# EasyEDA Pro project HT42B564-breakout.epro

# Schematic Schematic2
Board Name: CH37B Test Breakout; Create Date: 2025-04-11; Page Name: P1; Project Name: KeyStick; Schematic Name: Schematic2; Update Date: 2025-04-11; Company: EasyEDA.com; Page Size: A4; Version: V1.0
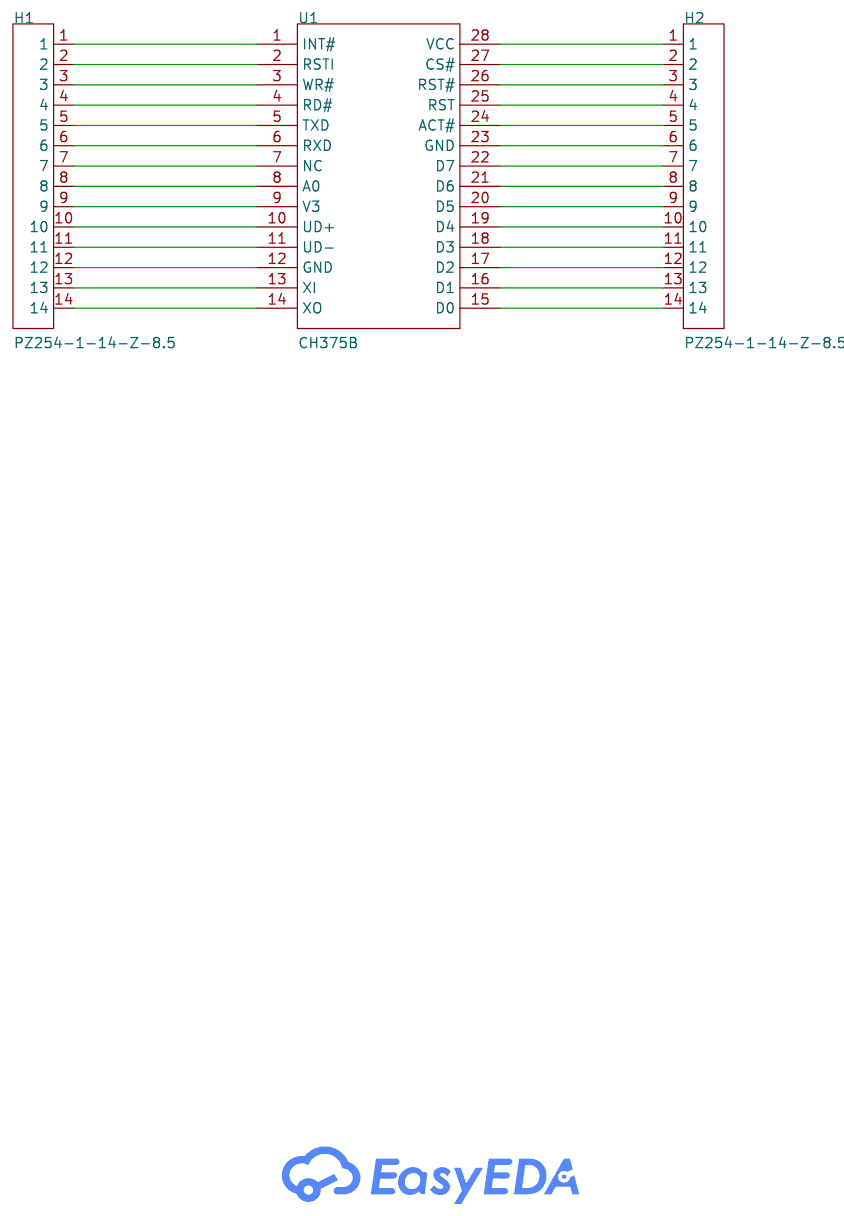
[diagram p0: schematic sheet]

## Parts
H1  PZ254-1-14-Z-8.5  [HDR-TH_14P-P2.54-V-M]
H2  PZ254-1-14-Z-8.5  [HDR-TH_14P-P2.54-V-M]
U1  CH375B  [SOIC-28_L17.9-W7.5-P1.27-LS10.3-BL]

## Library data of the parts
H1 H2 = PZ254-1-14-Z-8.5: Pin Structure:1x14P Pitch:2.54mm Row Spacing:- Circluar Pins/Square Pins:Policy Mounting Type:Straight Number of Rows:Single Row Number of Pins:14P Current Rating:3A Voltage Rating (Max):- Length of Mating Pin:6mm Insulation Height:2.5mm Length of End Con; LCSC Part Name: 1x14P 间距:2.54mm 方针 直插; Supplier Part: C2894937; Manufacturer: HCTL(华灿天禄); Supplier Footprint: 插件,P=2.54mm; JLCPCB Part Class: Extended Part; Datasheet: https://atta.szlcsc.com/upload/public/pdf/source/20240305/0F0A2A5C422E5D195558C9C26715A031.pdf; Supplier: LCSC; Pin Structure: 1x14P; Pitch: 2.54mm; Circluar Pins/Square Pins: Policy; Mounting Type: Straight; Number of Rows: Single Row; Number of Pins: 14P; Current Rating: 3A; Length of Mating Pin: 6mm; Insulation Height: 2.5mm; Length of End Connection Pin: 3mm; Contact Material: Brass; Operating Temperature: -40℃~+105℃; Color: Black
U1 = CH375B: Applications Function:Transceiver Protocol: Supply Voltage:3.3V；5V Supply Voltage:3.3V；5V Data Rate:12Mbps; LCSC Part Name: USB总线接口芯片CH375; Supplier Part: C8962; Manufacturer: WCH(南京沁恒); Supplier Footprint: SOP-28-300mil; JLCPCB Part Class: Extended Part; Datasheet: https://atta.szlcsc.com/upload/public/pdf/source/20240313/E60A362E05AFE3BBC545118421D5F1A4.pdf; Supplier: LCSC; Applications Function: Transceiver; Supply Voltage: 3.3V；5V; Data Rate: 12Mbps

## Nets
$1N662: H1.1 U1.1(INT#)
$1N666: H1.2 U1.2(RSTI)
$1N671: H1.3 U1.3(WR#)
$1N676: H1.4 U1.4(RD#)
$1N681: H1.5 U1.5(TXD)
$1N686: H1.6 U1.6(RXD)
$1N694: H1.7 U1.7(NC)
$1N698: H1.8 U1.8(A0)
$1N703: H1.9 U1.9(V3)
$1N711: H1.10 U1.10(UD+)
$1N715: H1.11 U1.11(UD-)
$1N720: H1.12 U1.12(GND)
$1N725: H1.13 U1.13(XI)
$1N730: H1.14 U1.14(XO)
$1N735: H2.1 U1.28(VCC)
$1N740: H2.2 U1.27(CS#)
$1N745: H2.3 U1.26(RST#)
$1N750: H2.4 U1.25(RST)
$1N755: H2.5 U1.24(ACT#)
$1N760: H2.6 U1.23(GND)
$1N765: H2.7 U1.22(D7)
$1N770: H2.8 U1.21(D6)
$1N775: H2.9 U1.20(D5)
$1N780: H2.10 U1.19(D4)
$1N785: H2.11 U1.18(D3)
$1N790: H2.12 U1.17(D2)
$1N795: H2.13 U1.16(D1)
$1N800: H2.14 U1.15(D0)

# Schematic Schematic1
Board Name: V1; Create Date: 2025-04-10; Page Name: P1; Project Name: KeyStick; Schematic Name: Schematic1; Update Date: 2025-04-10; Company: EasyEDA.com; Page Size: A4; Version: V1.0
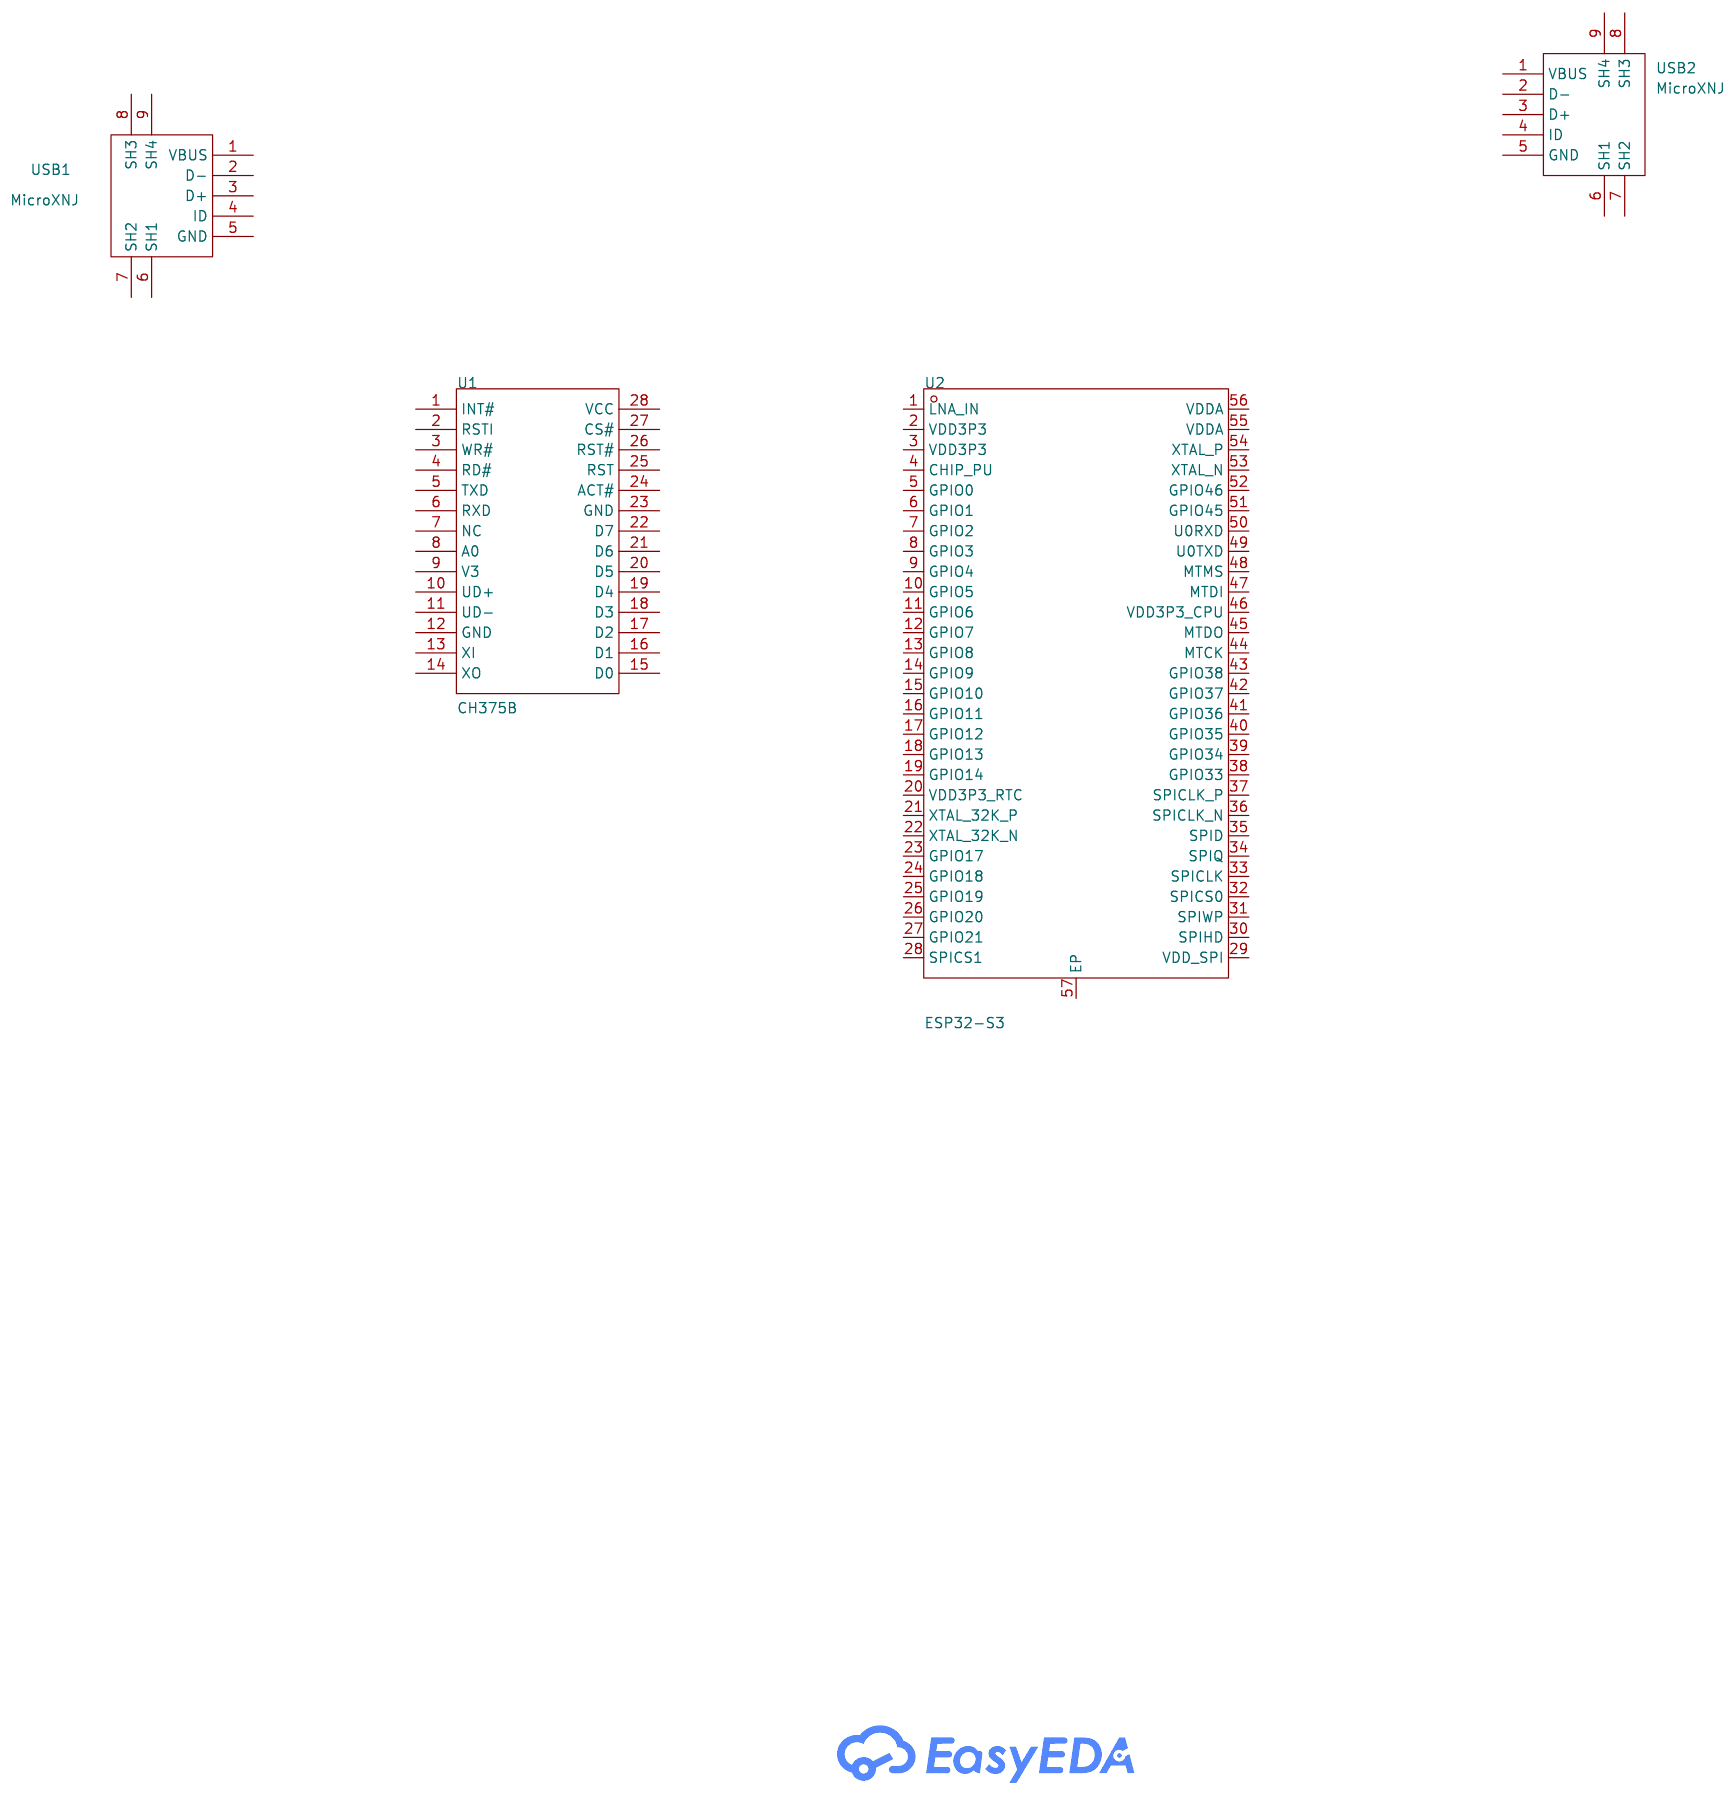
[diagram p1: schematic sheet]

## Parts
U1  CH375B  [SOIC-28_L17.9-W7.5-P1.27-LS10.3-BL]
U2  ESP32-S3  [QFN-56_L7.0-W7.0-P0.40-TL-EP4.0]
USB1  MicroXNJ  [MICRO-USB-SMD_MICROXNJ]
USB2  MicroXNJ  [MICRO-USB-SMD_MICROXNJ]

## Library data of the parts
U1 = CH375B: Applications Function:Transceiver Protocol: Supply Voltage:3.3V；5V Supply Voltage:3.3V；5V Data Rate:12Mbps; LCSC Part Name: USB总线接口芯片CH375; Supplier Part: C8962; Manufacturer: WCH(南京沁恒); Supplier Footprint: SOP-28-300mil; JLCPCB Part Class: Extended Part; Datasheet: https://atta.szlcsc.com/upload/public/pdf/source/20240313/E60A362E05AFE3BBC545118421D5F1A4.pdf; Supplier: LCSC; Applications Function: Transceiver; Supply Voltage: 3.3V；5V; Data Rate: 12Mbps
U2 = ESP32-S3: Frequency Range:2412MHz~2484MHz Frequency Range:2412MHz~2484MHz Interface:ADC,GPIO,I2C,I2S,PWM,SPI,UART,USB Operating Voltage:3V~3.6V Operating Voltage:3V~3.6V Applications:WiFi；IoT Output Power:21dBm Data Rate:150Mbps Current Of Transmitting:340mA Sensit; LCSC Part Name: 支持2.4GHz WIFI和低功耗蓝牙的MCU SoC; Supplier Part: C2913192; Manufacturer: ESPRESSIF(乐鑫); Supplier Footprint: QFN-56-EP(7x7); JLCPCB Part Class: Extended Part; Datasheet: https://atta.szlcsc.com/upload/public/pdf/source/20241030/3428D9BCA56E860957850BFAF37EAC62.pdf; Supplier: LCSC; Frequency Range: 2412MHz~2484MHz; Interface: ADC,GPIO,I2C,I2S,PWM,SPI,UART,USB; Operating Voltage: 3V~3.6V; Applications: WiFi；IoT; Output Power: 21dBm; Data Rate: 150Mbps; Current Of Transmitting: 340mA; Sensitivity: -98.4dBm; Receive Current: 88mA; Typical Application Frequency: 2.4GHz; Operating Temperature: -40℃~+105℃
USB1 USB2 = MicroXNJ: Connector Type:Micro-B Standard:USB 2.0 Gender:Female Mounting Style:Horizontal attachment Number of Contacts:5P Number of Ports:1 Current Rating - Power (Max):1.8A Operating Temperature Range:-20℃~+85℃ Operating Temperature Range:-20℃~+85℃ Rated Voltage; LCSC Part Name: Micro-B 母 卧贴; Supplier Part: C404969; Manufacturer: SHOU HAN(首韩); Supplier Footprint: SMD; JLCPCB Part Class: Extended Part; Datasheet: https://atta.szlcsc.com/upload/public/pdf/source/20220415/2494EDFF499AF6F852F7C820374B6AF3.pdf; Supplier: LCSC; Connector Type: Micro-B; Standard: USB 2.0; Gender: Female; Mounting Style: Horizontal attachment; Number of Contacts: 5P; Number of Ports: 1; Current Rating - Power (Max): 1.8A; Operating Temperature Range: -20℃~+85℃; Rated Voltage (Max): 30V; Connect-Disconnect Life: 5000 Cuts; Core Colour: Black

## Nets

Not connected (* = marked no-connect by the designer): U1 1(INT#) 2(RSTI) 3(WR#) 4(RD#) 5(TXD) 6(RXD) 7(NC) 8(A0) 9(V3) 10(UD+) 11(UD-) 12(GND) 13(XI) 14(XO) 15(D0) 16(D1) 17(D2) 18(D3) 19(D4) 20(D5) 21(D6) 22(D7) 23(GND) 24(ACT#) 25(RST) 26(RST#) 27(CS#) 28(VCC); U2 1(LNA_IN) 2(VDD3P3) 3(VDD3P3) 4(CHIP_PU) 5(GPIO0) 6(GPIO1) 7(GPIO2) 8(GPIO3) 9(GPIO4) 10(GPIO5) 11(GPIO6) 12(GPIO7) 13(GPIO8) 14(GPIO9) 15(GPIO10) 16(GPIO11) 17(GPIO12) 18(GPIO13) 19(GPIO14) 20(VDD3P3_RTC) 21(XTAL_32K_P) 22(XTAL_32K_N) 23(GPIO17) 24(GPIO18) 25(GPIO19) 26(GPIO20) 27(GPIO21) 28(SPICS1) 29(VDD_SPI) 30(SPIHD) 31(SPIWP) 32(SPICS0) 33(SPICLK) 34(SPIQ) 35(SPID) 36(SPICLK_N) 37(SPICLK_P) 38(GPIO33) 39(GPIO34) 40(GPIO35) 41(GPIO36) 42(GPIO37) 43(GPIO38) 44(MTCK) 45(MTDO) 46(VDD3P3_CPU) 47(MTDI) 48(MTMS) 49(U0TXD) 50(U0RXD) 51(GPIO45) 52(GPIO46) 53(XTAL_N) 54(XTAL_P) 55(VDDA) 56(VDDA) 57(EP); USB1 1(VBUS) 2(D-) 3(D+) 4(ID) 5(GND) 6(SH1) 7(SH2) 8(SH3) 9(SH4); USB2 1(VBUS) 2(D-) 3(D+) 4(ID) 5(GND) 6(SH1) 7(SH2) 8(SH3) 9(SH4)

# Schematic Schematic3
Board Name: HT42B564 Test Breakout; Create Date: 2025-04-17; Page Name: P1; Project Name: KeyStick; Schematic Name: Schematic3; Update Date: 2025-04-17; Company: EasyEDA.com; Page Size: A4; Version: V1.0
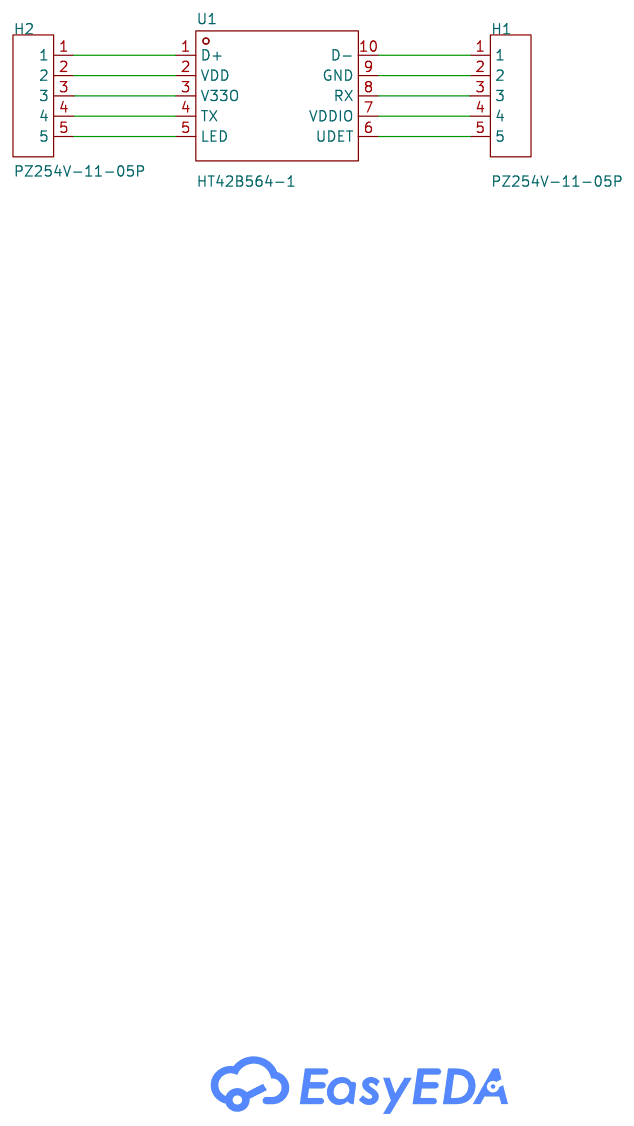
[diagram p2: schematic sheet]

## Parts
H1  PZ254V-11-05P  [HDR-TH_5P-P2.54-V-M]
H2  PZ254V-11-05P  [HDR-TH_5P-P2.54-V-M]
U1  HT42B564-1  [SSOP-10_L4.9-W3.9-P1.00-LS6.0-BL]

## Library data of the parts
H1 H2 = PZ254V-11-05P: Pin Structure:1x5P Pitch:2.54mm Row Spacing:- Circluar Pins/Square Pins:Policy Mounting Type:Straight Number of Rows:Single Row Number of Pins:5P Current Rating:- Voltage Rating (Max):- Length of Mating Pin:6mm Insulation Height:2.5mm Length of End Connec; LCSC Part Name: 1x5P 间距:2.54mm 方针 直插; Supplier Part: C492404; Manufacturer: XFCN(兴飞); Supplier Footprint: 插件,P=2.54mm; JLCPCB Part Class: Extended Part; Datasheet: https://atta.szlcsc.com/upload/public/pdf/source/20200309/C492404_E51533260F8710EFF5D4617281164C1D.pdf; Supplier: LCSC; Pin Structure: 1x5P; Pitch: 2.54mm; Circluar Pins/Square Pins: Policy; Mounting Type: Straight; Number of Rows: Single Row; Number of Pins: 5P; Length of Mating Pin: 6mm; Insulation Height: 2.5mm; Length of End Connection Pin: 3mm; Contact Material: Brass; Operating Temperature: -40℃~+105℃; Color: Black
U1 = HT42B564-1: Applications Function:USB转UART Protocol:UART Number of Channels:- Supply Voltage:3.3V~5.5V Supply Voltage:3.3V~5.5V Data Rate:- Operating Temperature:- Operating Temperature:-; Supplier Part: C109026; Manufacturer: HOLTEK(合泰/盛群); Supplier Footprint: SOP-10; JLCPCB Part Class: Extended Part; Datasheet: https://atta.szlcsc.com/upload/public/pdf/source/20240403/82092C50D54317D0FB1B4FEE6092E3E6.pdf; Supplier: LCSC; Applications Function: USB转UART; Protocol: UART; Supply Voltage: 3.3V~5.5V

## Nets
$1N293: H2.1 U1.1(D+)
$1N297: H2.2 U1.2(VDD)
$1N302: H2.3 U1.3(V33O)
$1N307: H2.4 U1.4(TX)
$1N312: H2.5 U1.5(LED)
$1N317: H1.1 U1.10(D-)
$1N322: H1.2 U1.9(GND)
$1N327: H1.3 U1.8(RX)
$1N332: H1.4 U1.7(VDDIO)
$1N337: H1.5 U1.6(UDET)

# Board PCB2
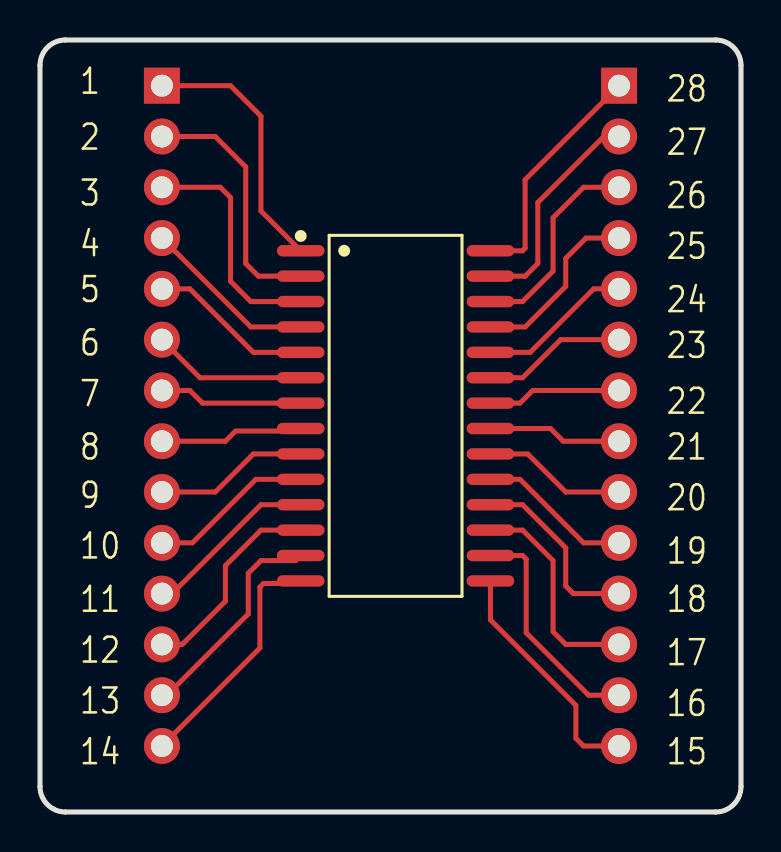
[diagram p3: board, top side]
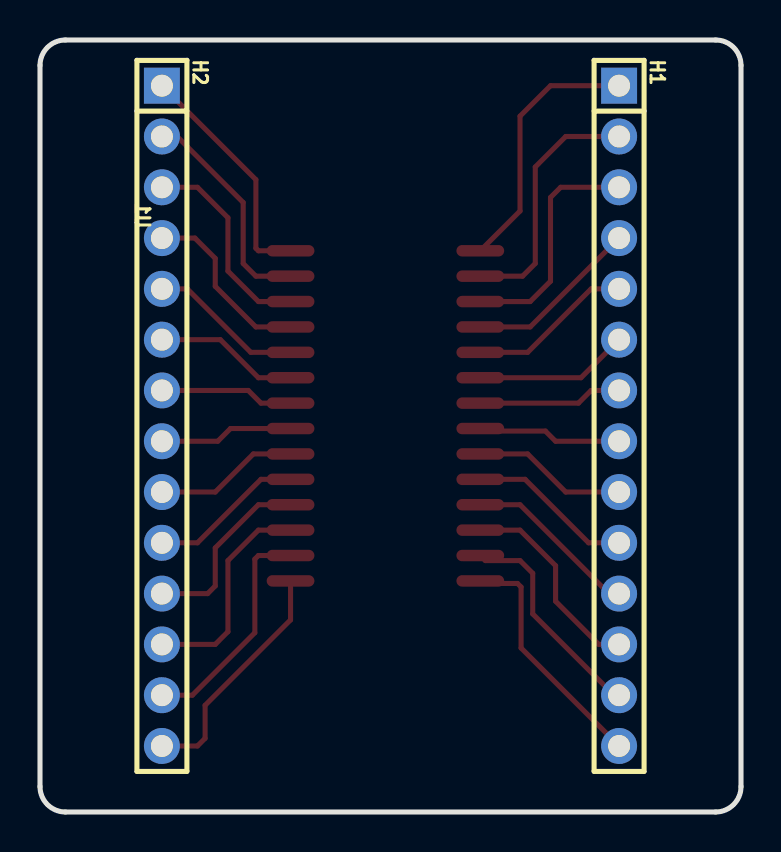
[diagram p4: board, bottom side, seen from below]

Outline 35.05 x 38.61 mm; copper layers: Top Layer, Bottom Layer. Coordinates in mm from the lower left corner of the outline.
Outline path: 0,37.34 0,1.27 arc(0.37,0.37) 1.27,0 33.78,0 arc(34.68,0.37) 35.05,1.27 35.05,37.34 arc(34.68,38.24) 33.78,38.61 1.27,38.61 arc(0.37,38.24) 0,37.34
Stack: Top Layer 0.035mm / Dielectric1 1.51mm FR4 er 4.5 / Bottom Layer 0.035mm

## Design rules (mm)
template: JLCPCB Capability(Two Layers Board)
spacing copperThickness1oz (default): track to track 0.102, other pairs 0.152 to 0.3
spacing copperThickness2oz: track to track 0.203, other pairs 0.152 to 0.3
track width copperThickness1oz (default): min 0.127, default 0.254, max 2.54
track width copperThickness2oz: min 0.203, default 0.254, max 2.54
differential pair differentialPair (default): width min 0.127, default 0.254, max 2.54; gap min 0.152, default 0.152
via viaSize (default): diameter min 0.5, default 0.61, max 10; hole min 0.3, default 0.305, max 6.3

## Placement (name value [footprint] x y rotation side)
H1  PZ254-1-14-Z-8.5  [HDR-TH_14P-P2.54-V-M]  6.1 19.81 270 bottom
H2  PZ254-1-14-Z-8.5  [HDR-TH_14P-P2.54-V-M]  28.96 19.81 270 bottom
U1  CH375B  [SOIC-28_L17.9-W7.5-P1.27-LS10.3-BL]  17.78 19.81 270 top

## Footprints (pads in the part's own frame, mm; a bottom-side part is the same pattern mirrored in y, then rotated)
HDR-TH_14P-P2.54-V-M
  rect 1.8x1.8 hole 1.1: 1(-16.51,0)
  round 1.8 hole 1.1: 2(-13.97,0) 3(-11.43,0) 4(-8.89,0) 5(-6.35,0) 6(-3.81,0) 7(-1.27,0) 8(1.27,0) 9(3.81,0) 10(6.35,0) 11(8.89,0) 12(11.43,0) 13(13.97,0) 14(16.51,0)
SOIC-28_L17.9-W7.5-P1.27-LS10.3-BL
  oval 0.574x2.388 smd: 1(-8.255,-4.744) 2(-6.985,-4.744) 3(-5.715,-4.744) 4(-4.445,-4.744) 5(-3.175,-4.744) 6(-1.905,-4.744) 7(-0.635,-4.744) 8(0.635,-4.744) 9(1.905,-4.744) 10(3.175,-4.744) 11(4.445,-4.744) 12(5.715,-4.744) 13(6.985,-4.744) 14(8.255,-4.744) 15(8.255,4.744) 16(6.985,4.744) 17(5.715,4.744) 18(4.445,4.744) 19(3.175,4.744) 20(1.905,4.744) 21(0.635,4.744) 22(-0.635,4.744) 23(-1.905,4.744) 24(-3.175,4.744) 25(-4.445,4.744) 26(-5.715,4.744) 27(-6.985,4.744) 28(-8.255,4.744)

## Nets
As in the schematic.

## Routing (per net, layer and track width the routed paths; a pad name or vN(x,y) marks a point on that pad's centre or on a via; arc(x,y) is an arc through that point)
$1N662: length 13.1
  Top Layer w0.254: U1.1 11.05,30.05 11.05,34.8 9.53,36.32 H1.1
$1N666: length 12.7
  Top Layer w0.254: H1.2 8.76,33.78 10.29,32.26 10.29,27.43 10.92,26.8 U1.2
$1N671: length 11.8
  Top Layer w0.254: U1.3 10.54,25.53 9.53,26.54 9.53,30.73 9.02,31.24 H1.3
$1N676: length 8.8
  Top Layer w0.254: H1.4 10.54,24.26 U1.4
$1N681: length 8.3
  Top Layer w0.254: H1.5 7.49,26.16 10.67,22.99 U1.5
$1N686: length 7.7
  Top Layer w0.254: U1.6 8,21.72 H1.6
$1N694: length 7.2
  Top Layer w0.254: U1.7 8.13,20.45 7.49,21.08 H1.7
$1N698: length 7.2
  Top Layer w0.254: H1.8 9.27,18.54 9.78,19.05 12.91,19.05 U1.8
$1N703: length 7.7
  Top Layer w0.254: U1.9 10.67,17.91 8.76,16 H1.9
$1N711: length 8.3
  Top Layer w0.254: H1.10 7.62,13.46 10.8,16.64 U1.10
$1N715: length 8.8
  Top Layer w0.254: H1.11 6.6,10.92 11.05,15.37 U1.11
$1N720: length 10.3
  Top Layer w0.254: H1.12 7.11,8.38 9.27,10.54 9.27,12.32 11.05,14.1 U1.12
$1N725: length 11
  Top Layer w0.254: H1.13 6.35,5.84 10.41,9.91 10.41,11.94 11.05,12.57 12.78,12.57 U1.13
$1N730: length 12.1
  Top Layer w0.254: U1.14 12.91,11.43 11.18,11.43 11,11.25 11,8.2 H1.14
$1N735: length 11.9
  Top Layer w0.254: U1.28 24.13,28.07 24.26,28.19 24.26,31.62 H2.1
$1N740: length 11.1
  Top Layer w0.254: H2.2 28.19,33.78 24.89,30.48 24.89,27.43 24.26,26.8 U1.27
$1N745: length 10.4
  Top Layer w0.254: U1.26 24.13,25.53 25.65,27.05 25.65,29.72 27.18,31.24 H2.3
$1N750: length 9.1
  Top Layer w0.254: U1.25 24.26,24.26 26.29,26.29 26.29,27.69 27.31,28.7 H2.4
$1N755: length 7.7
  Top Layer w0.254: U1.24 24.51,22.99 27.69,26.16 H2.5
$1N760: length 7.2
  Top Layer w0.254: U1.23 24.13,21.72 26.03,23.62 H2.6
$1N765: length 6.7
  Top Layer w0.254: U1.22 24,20.45 24.64,21.08 H2.7
$1N770: length 6.7
  Top Layer w0.254: U1.21 25.53,19.18 26.16,18.54 H2.8
$1N775: length 7.2
  Top Layer w0.254: H2.9 26.29,16 24.38,17.91 U1.20
$1N780: length 7.7
  Top Layer w0.254: U1.19 24,16.64 27.18,13.46 H2.10
$1N785: length 9.4
  Top Layer w0.254: U1.18 24.13,15.37 26.29,13.21 26.29,11.3 26.67,10.92 H2.11
$1N790: length 10.9
  Top Layer w0.254: U1.17 24.13,14.1 25.65,12.57 25.65,9.02 26.29,8.38 H2.12
$1N795: length 11.5
  Top Layer w0.254: H2.13 27.43,5.84 24.31,8.96 24.31,12.65 24.13,12.83 U1.16
$1N800: length 12
  Top Layer w0.254: H2.14 27.18,3.3 26.8,3.68 26.8,5.33 22.52,9.61 U1.15

## Text on the board
Top Silkscreen Layer: 1 | 2 | 3 | 4 | 5 | 6 | 7 | 8 | 9 | 10 | 11 | 12 | 13 | 14 | 28 | 27 | 26 | 25 | 24 | 23 | 22 | 21 | 20 | 19 | 18 | 17 | 16 | 15

# Board PCB3
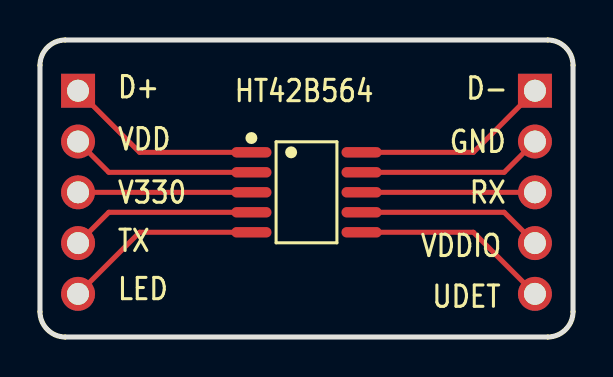
[diagram p5: board, top side]
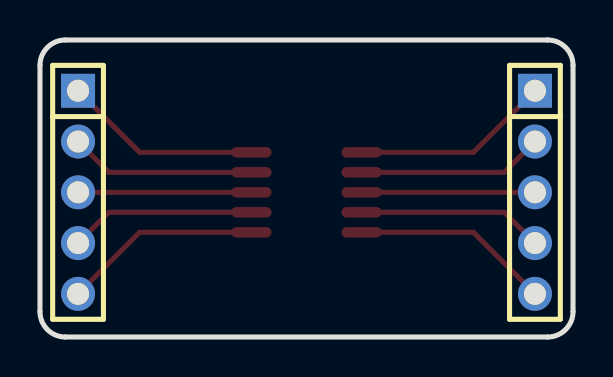
[diagram p6: board, bottom side, seen from below]

Outline 26.67 x 14.86 mm; copper layers: Top Layer, Bottom Layer. Coordinates in mm from the lower left corner of the outline.
Outline path: 0,13.59 0,1.27 arc(0.37,0.37) 1.27,0 25.4,0 arc(26.3,0.37) 26.67,1.27 26.67,13.59 arc(26.3,14.49) 25.4,14.86 1.27,14.86 arc(0.37,14.49) 0,13.59
Stack: Top Layer 0.035mm / Dielectric1 1.51mm FR4 er 4.5 / Bottom Layer 0.035mm

## Design rules (mm)
template: JLCPCB Capability(Two Layers Board)
spacing copperThickness1oz (default): track to track 0.102, other pairs 0.152 to 0.3
spacing copperThickness2oz: track to track 0.203, other pairs 0.152 to 0.3
track width copperThickness1oz (default): min 0.127, default 0.254, max 2.54
track width copperThickness2oz: min 0.203, default 0.254, max 2.54
differential pair differentialPair (default): width min 0.127, default 0.254, max 2.54; gap min 0.152, default 0.152
via viaSize (default): diameter min 0.5, default 0.61, max 10; hole min 0.3, default 0.305, max 6.3

## Placement (name value [footprint] x y rotation side)
H1  PZ254V-11-05P  [HDR-TH_5P-P2.54-V-M]  24.77 7.24 270 bottom
H2  PZ254V-11-05P  [HDR-TH_5P-P2.54-V-M]  1.91 7.24 270 bottom
U1  HT42B564-1  [SSOP-10_L4.9-W3.9-P1.00-LS6.0-BL]  13.34 7.24 270 top

## Footprints (pads in the part's own frame, mm; a bottom-side part is the same pattern mirrored in y, then rotated)
HDR-TH_5P-P2.54-V-M
  rect 1.7x1.7 hole 1.1: 1(-5.08,0)
  round 1.7 hole 1.1: 2(-2.54,0) 3(0,0) 4(2.54,0) 5(5.08,0)
SSOP-10_L4.9-W3.9-P1.00-LS6.0-BL
  oval 0.525x2.014 smd: 1(-2,-2.756) 2(-1,-2.756) 3(0,-2.756) 4(1,-2.756) 5(2,-2.756) 6(2,2.756) 7(1,2.756) 8(0,2.756) 9(-1,2.756) 10(-2,2.756)

## Nets
As in the schematic.

## Routing (per net, layer and track width the routed paths; a pad name or vN(x,y) marks a point on that pad's centre or on a via; arc(x,y) is an arc through that point)
$1N293: length 9.9
  Top Layer w0.254: U1.1 4.99,9.24 H2.1
$1N297: length 9.3
  Top Layer w0.254: U1.2 3.44,8.24 H2.2
$1N302: length 8.7
  Top Layer w0.254: U1.3 H2.3
$1N307: length 9.3
  Top Layer w0.254: U1.4 3.44,6.24 H2.4
$1N312: length 9.9
  Top Layer w0.254: H2.5 4.99,5.24 U1.5
$1N317: length 9.9
  Top Layer w0.254: H1.1 21.69,9.24 U1.10
$1N322: length 9.3
  Top Layer w0.254: U1.9 23.22,8.24 H1.2
$1N327: length 8.7
  Top Layer w0.254: U1.8 H1.3
$1N332: length 9.3
  Top Layer w0.254: U1.7 23.22,6.24 H1.4
$1N337: length 9.9
  Top Layer w0.254: H1.5 21.69,5.24 U1.6

## Text on the board
Top Silkscreen Layer: D+ | VDD | V330 | TX | LED | HT42B564 | VDDIO | UDET | GND | D- | RX
